# Altium project SVPXFMC_Carrier_6U.PrjPcb (part 9 of 9)
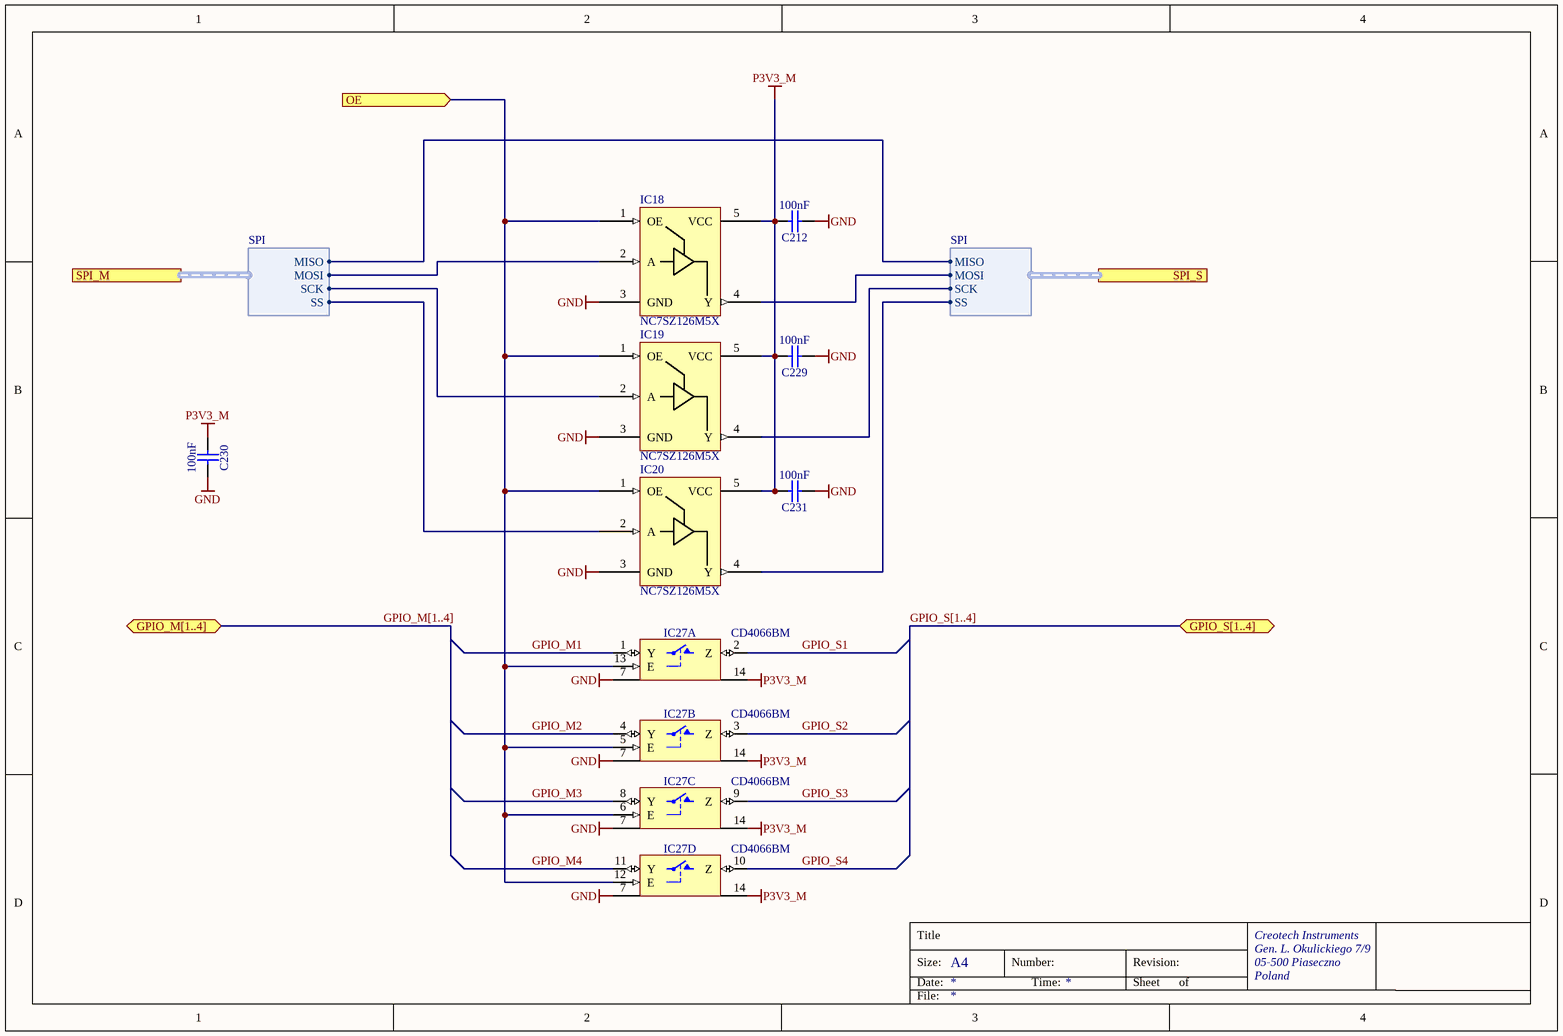
[diagram p24: Interface_Protection.SchDoc]

## Nets that join several sheets (continued)
SpW_B_Sin_P: FMC Carrier Channel2/FPGA_RGMII_Misc (U2B#2.L5), HDN_Control_Data (P1.A13)
SpW_B_Sout_N: FMC Carrier Channel2/FPGA_RGMII_Misc (U2B#2.K4), HDN_Control_Data (P1.E13)
SpW_B_Sout_P: FMC Carrier Channel2/FPGA_RGMII_Misc (U2B#2.K5), HDN_Control_Data (P1.D13)
TxD: MSP_Telemetry (IC29.8), MSP_Power_Program (D16.4 J1.3)
VADJ: FMC Carrier Channel1/U_FMC_connector (8 pins), FMC Carrier Channel1/Supply for FPGA, FMC and SDRAM (IC7A.5 R21A.2)
VADJ: FMC Carrier Channel2/U_FMC_connector (8 pins), FMC Carrier Channel2/Supply for FPGA, FMC and SDRAM (IC7B.5 R21B.2)